# EAGLE design Nu6509_vossi_v2 (EAGLE 7.7.0)
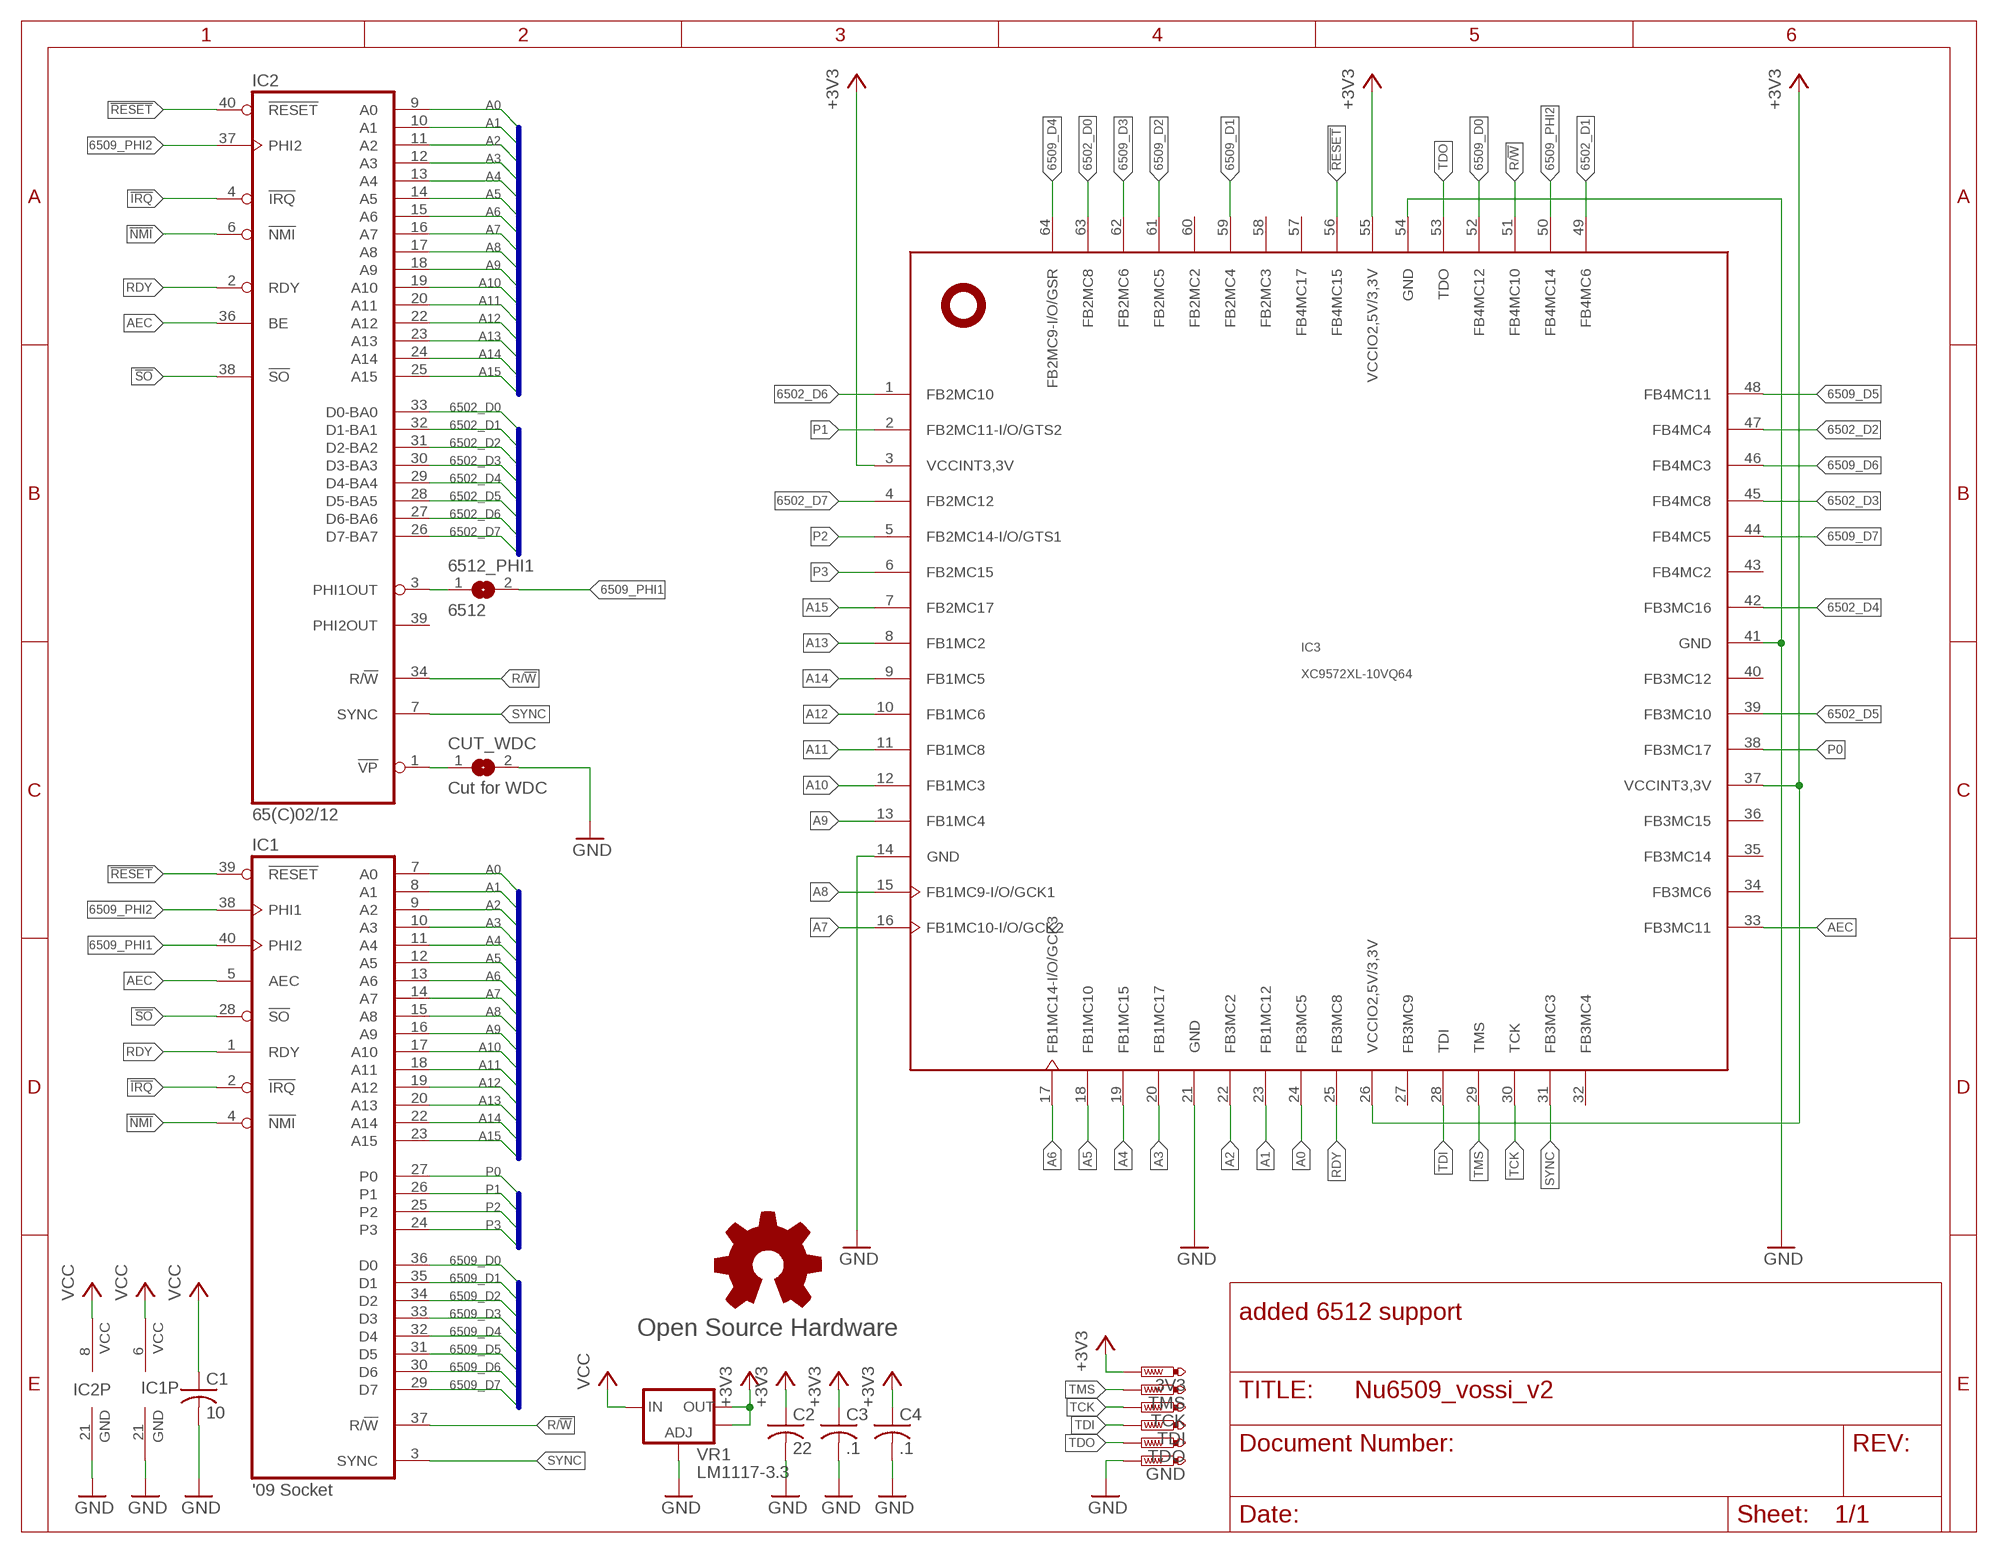
[diagram p0: schematic, sheet 1]

## Parts
3V3  PTR1TP08R  [TP08R]
6512_PHI1  6512  SJ  [SJ]
C1  10  C-USC0805  [C0805]
C2  22  C-USC0805  [C0805]
C3  .1  C-USC0805  [C0805]
C4  .1  C-USC0805  [C0805]
CUT_WDC  Cut for WDC  SJ  [SJ]
GND  PTR1TP08R  [TP08R]
GOLD_ORB_SM1  Open Source Hardware  OSHWLOGOLOGO5MM  [OSHW_5MM]
IC1  '09 Socket  6509-RP  [DIL40-ROUNDPAD]
IC2  65(C)02/12  W65C02S-RP  [DIL40-ROUNDPAD]
IC3  XC9572XL-10VQ64  XC9572XLVQG64  [VQFP64]
TCK  PTR1TP08R  [TP08R]
TDI  PTR1TP08R  [TP08R]
TDO  PTR1TP08R  [TP08R]
TMS  PTR1TP08R  [TP08R]
VR1  LM1117-3.3  V_REG_LM1117SOT223  [SOT223]

## Nets
6502_D0: IC2.33(D0-BA0) IC3.63(FB2MC8)
6502_D1: IC2.32(D1-BA1) IC3.49(FB4MC6)
6502_D2: IC2.31(D2-BA2) IC3.47(FB4MC4)
6502_D3: IC2.30(D3-BA3) IC3.45(FB4MC8)
6502_D4: IC2.29(D4-BA4) IC3.42(FB3MC16)
6502_D5: IC2.28(D5-BA5) IC3.39(FB3MC10)
6502_D6: IC2.27(D6-BA6) IC3.1(FB2MC10)
6502_D7: IC2.26(D7-BA7) IC3.4(FB2MC12)
6502_VSS: CUT_WDC.1 IC2.1(!VP)
6509_D0: IC1.36(D0) IC3.52(FB4MC12)
6509_D1: IC1.35(D1) IC3.59(FB2MC4)
6509_D2: IC1.34(D2) IC3.61(FB2MC5)
6509_D3: IC1.33(D3) IC3.62(FB2MC6)
6509_D4: IC1.32(D4) IC3.64(FB2MC9-I/O/GSR)
6509_D5: IC1.31(D5) IC3.48(FB4MC11)
6509_D6: IC1.30(D6) IC3.46(FB4MC3)
6509_D7: IC1.29(D7) IC3.44(FB4MC5)
6509_PHI1: 6512_PHI1.2 IC1.40(PHI2)
6509_PHI2: IC1.38(PHI1) IC2.37(PHI2) IC3.50(FB4MC14)
6512_PHI1: 6512_PHI1.1 IC2.3(PHI1OUT)
!IRQ: IC1.2(!IRQ) IC2.4(!IRQ)
!NMI: IC1.4(!NMI) IC2.6(!NMI)
!RESET: IC1.39(!RESET) IC2.40(!RESET) IC3.56(FB4MC15)
!SO: IC1.28(!SO) IC2.38(!SO)
+3V3: 3V3.TP C2.1 C3.1 C4.1 IC3.3(VCCINT3,3V) IC3.26(VCCIO2,5V/3,3V) IC3.37(VCCINT3,3V) IC3.55(VCCIO2,5V/3,3V) VR1.2(OUT) VR1.4(OUT)
A0: IC1.7(A0) IC2.9(A0) IC3.24(FB3MC5)
A1: IC1.8(A1) IC2.10(A1) IC3.23(FB1MC12)
A2: IC1.9(A2) IC2.11(A2) IC3.22(FB3MC2)
A3: IC1.10(A3) IC2.12(A3) IC3.20(FB1MC17)
A4: IC1.11(A4) IC2.13(A4) IC3.19(FB1MC15)
A5: IC1.12(A5) IC2.14(A5) IC3.18(FB1MC10)
A6: IC1.13(A6) IC2.15(A6) IC3.17(FB1MC14-I/O/GCK3)
A7: IC1.14(A7) IC2.16(A7) IC3.16(FB1MC10-I/O/GCK2)
A8: IC1.15(A8) IC2.17(A8) IC3.15(FB1MC9-I/O/GCK1)
A9: IC1.16(A9) IC2.18(A9) IC3.13(FB1MC4)
A10: IC1.17(A10) IC2.19(A10) IC3.12(FB1MC3)
A11: IC1.18(A11) IC2.20(A11) IC3.11(FB1MC8)
A12: IC1.19(A12) IC2.22(A12) IC3.10(FB1MC6)
A13: IC1.20(A13) IC2.23(A13) IC3.8(FB1MC2)
A14: IC1.22(A14) IC2.24(A14) IC3.9(FB1MC5)
A15: IC1.23(A15) IC2.25(A15) IC3.7(FB2MC17)
AEC: IC1.5(AEC) IC2.36(BE) IC3.33(FB3MC11)
GND: C1.2 C2.2 C3.2 C4.2 CUT_WDC.2 GND.TP IC1.21(GND) IC2.21(GND) IC3.14(GND) IC3.21(GND) IC3.41(GND) IC3.54(GND) VR1.1(ADJ)
P0: IC1.27(P0) IC3.38(FB3MC17)
P1: IC1.26(P1) IC3.2(FB2MC11-I/O/GTS2)
P2: IC1.25(P2) IC3.5(FB2MC14-I/O/GTS1)
P3: IC1.24(P3) IC3.6(FB2MC15)
R/!W: IC1.37(R/!W) IC2.34(R/!W) IC3.51(FB4MC10)
RDY: IC1.1(RDY) IC2.2(RDY) IC3.25(FB3MC8)
SYNC: IC1.3(SYNC) IC2.7(SYNC) IC3.31(FB3MC3)
TCK: IC3.30(TCK) TCK.TP
TDI: IC3.28(TDI) TDI.TP
TDO: IC3.53(TDO) TDO.TP
TMS: IC3.29(TMS) TMS.TP
VCC: C1.1 IC1.6(VCC) IC2.8(VCC) VR1.3(IN)
Unconnected: IC2.39(PHI2OUT) IC3.27(FB3MC9) IC3.32(FB3MC4) IC3.34(FB3MC6) IC3.35(FB3MC14) IC3.36(FB3MC15) IC3.40(FB3MC12) IC3.43(FB4MC2) IC3.57(FB4MC17) IC3.58(FB2MC3) IC3.60(FB2MC2)

## Buses
A[0..15]
6502_D[0..7]
P[0..3]
6509_D[0..7]

## Notes on the sheet
- added 6512 support

## Library data of the parts
3V3 GND TCK TDI TDO TMS = testpad:PTR1: TEST PIN
6512_PHI1 CUT_WDC = jumper-jlb:SJ: SMD solder JUMPER
C1-C4 = rcl:C-US: CAPACITOR, American symbol
GOLD_ORB_SM1 = oshw:OSHWLOGO: The OSHW logo for PCB layout
IC1 = commodore:6509
IC2 = commodore:W65C02S: WDC W65C02S
IC3 = xilinx_xc95XXXxl:XC9572XLVQG64
VR1 = SparkFun:V_REG_LM1117: Voltage Regulator LM1117 Standard adjustable voltage regulator but in SMD form. Spark Fun Electronics SKU : COM-00595

## Board
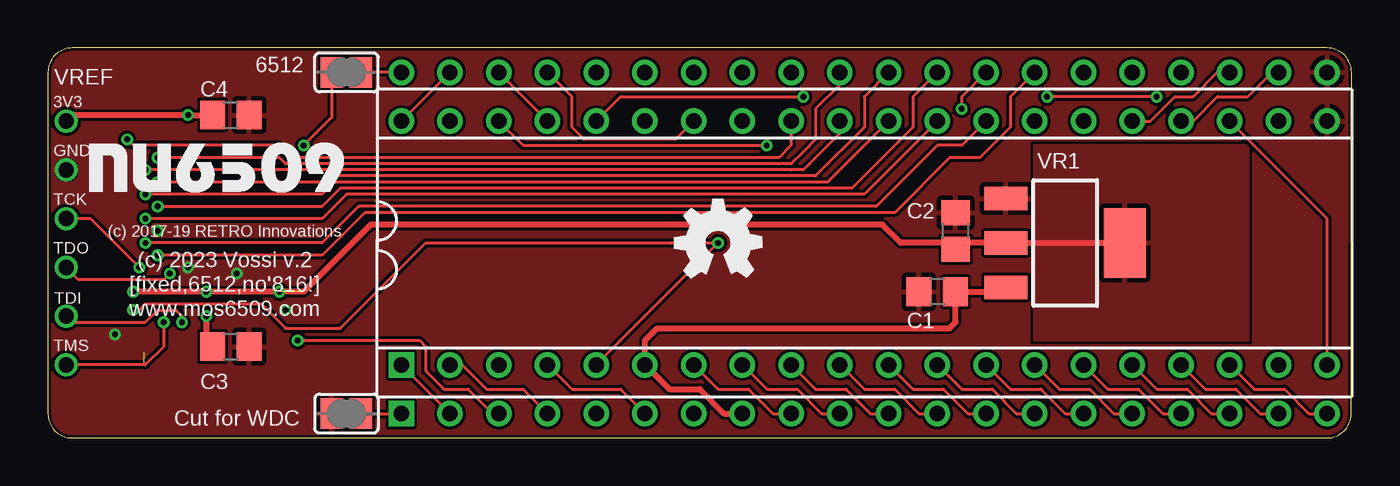
[diagram p1: board, top side]
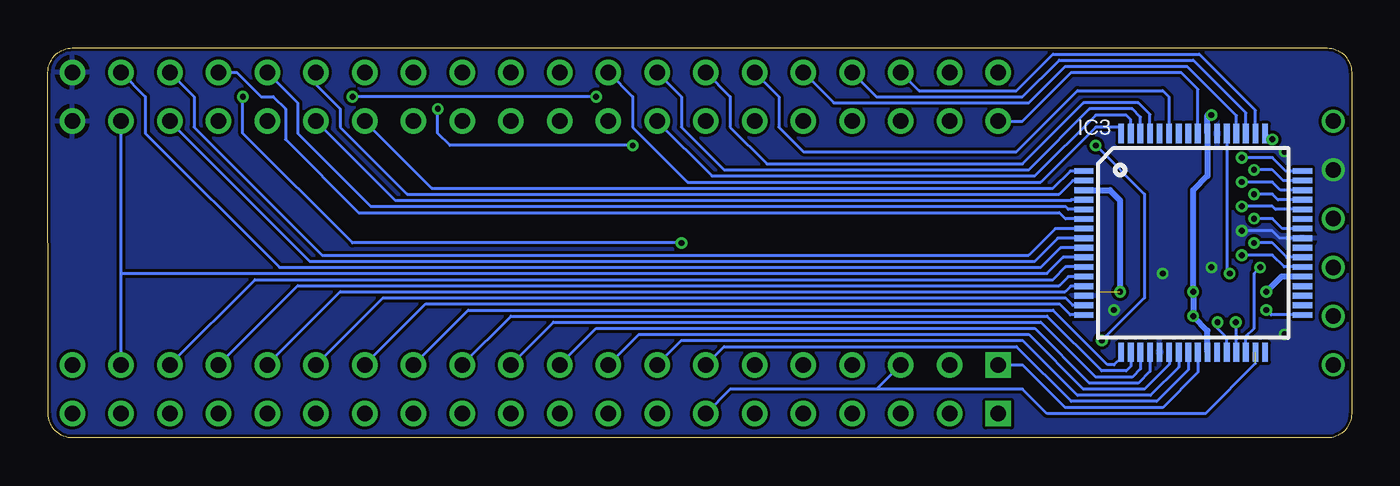
[diagram p2: board, bottom side, seen from below]

Size 67.94 x 20.32 mm. Coordinates in mm from the lower left corner, seen from the top.
Outline: 0,19.05 0,1.27 arc90 1.27,0 66.66,0 arc90 67.93,1.27 67.94,19.05 arc90 66.67,20.32 1.27,20.32 arc90 0,19.05
Copper layers (1*16): Top 0.035mm / dielectric 1.5mm / Bottom 0.035mm
Design rules "hackvana *": minimum track width 6mil, minimum drill 0.3mm, track to track 6mil, track to pad 6mil, pad to pad 6mil, via to via 6mil, smd to smd 0mil, copper to edge 6mil, drill to drill 6mil, minimum pad ring 10mil, minimum via ring 6mil, stop-mask expansion 2mil, vias tented up to drill 100mil, thermal gap 10mil

### Footprints (pad centres in the part's own frame; a part is rotated, then mirrored left to right if it is on the bottom)
TP08R = smd 0.8 x 0.8: TP 0,0
SJ = smd 1.168 x 1.6: 1 -0.762,0; 2 0.762,0
C0805 = smd 1.3 x 1.5: 1 -0.95,0; 2 0.95,0
DIL40-ROUNDPAD = drill 0.813 square: 1 -24.13,-7.62 | drill 0.813: 2 -21.59,-7.62; 3 -19.05,-7.62; 4 -16.51,-7.62; 5 -13.97,-7.62; 6 -11.43,-7.62; 7 -8.89,-7.62; 8 -6.35,-7.62; 9 -3.81,-7.62; 10 -1.27,-7.62; 11 1.27,-7.62; 12 3.81,-7.62; 13 6.35,-7.62; 14 8.89,-7.62; 15 11.43,-7.62; 16 13.97,-7.62; 17 16.51,-7.62; 18 19.05,-7.62; 19 21.59,-7.62; 20 24.13,-7.62; 21 24.13,7.62; 22 21.59,7.62; 23 19.05,7.62; 24 16.51,7.62; 25 13.97,7.62; 26 11.43,7.62; 27 8.89,7.62; 28 6.35,7.62; 29 3.81,7.62; 30 1.27,7.62; 31 -1.27,7.62; 32 -3.81,7.62; 33 -6.35,7.62; 34 -8.89,7.62; 35 -11.43,7.62; 36 -13.97,7.62; 37 -16.51,7.62; 38 -19.05,7.62; 39 -21.59,7.62; 40 -24.13,7.62
VQFP64 = smd 1 x 0.3: 1 -5.7,3.75; 2 -5.7,3.25; 3 -5.7,2.75; 4 -5.7,2.25; 5 -5.7,1.75; 6 -5.7,1.25; 7 -5.7,0.75; 8 -5.7,0.25; 9 -5.7,-0.25; 10 -5.7,-0.75; 11 -5.7,-1.25; 12 -5.7,-1.75; 13 -5.7,-2.25; 14 -5.7,-2.75; 15 -5.7,-3.25; 16 -5.7,-3.75; 33 5.7,-3.75; 34 5.7,-3.25; 35 5.7,-2.75; 36 5.7,-2.25; 37 5.7,-1.75; 38 5.7,-1.25; 39 5.7,-0.75; 40 5.7,-0.25; 41 5.7,0.25; 42 5.7,0.75; 43 5.7,1.25; 44 5.7,1.75; 45 5.7,2.25; 46 5.7,2.75; 47 5.7,3.25; 48 5.7,3.75 | smd 0.3 x 1: 17 -3.75,-5.7; 18 -3.25,-5.7; 19 -2.75,-5.7; 20 -2.25,-5.7; 21 -1.75,-5.7; 22 -1.25,-5.7; 23 -0.75,-5.7; 24 -0.25,-5.7; 25 0.25,-5.7; 26 0.75,-5.7; 27 1.25,-5.7; 28 1.75,-5.7; 29 2.25,-5.7; 30 2.75,-5.7; 31 3.25,-5.7; 32 3.75,-5.7; 49 3.75,5.7; 50 3.25,5.7; 51 2.75,5.7; 52 2.25,5.7; 53 1.75,5.7; 54 1.25,5.7; 55 0.75,5.7; 56 0.25,5.7; 57 -0.25,5.7; 58 -0.75,5.7; 59 -1.25,5.7; 60 -1.75,5.7; 61 -2.25,5.7; 62 -2.75,5.7; 63 -3.25,5.7; 64 -3.75,5.7
SOT223 = smd 1.219 x 2.235: 1 -2.311,-3.099; 2 0,-3.099; 3 2.311,-3.099 | smd 3.6 x 2.2: 4 0,3.099

### Placement (x,y rotation side)
3V3  0.95,16.51 0 top
6512_PHI1  15.56,19.05 0 top
C1  46.35,7.62 180 top
C2  47.31,10.79 90 top
C3  9.53,4.76 0 top
C4  9.53,16.83 0 top
CUT_WDC  15.56,1.27 180 top
GND  0.95,13.97 0 top
GOLD_ORB_SM1  34.92,10.16 0 top
IC1  42.54,11.43 0 top
IC2  42.54,8.89 0 top
IC3  8.25,10.16 0 bottom
TCK  0.95,11.43 0 top
TDI  0.95,6.35 0 top
TDO  0.95,8.89 0 top
TMS  0.95,3.81 0 top
VR1  53.02,10.16 270 top

### Tracks (layer width: path | path; a pad name or v marks a point on that pad's centre or on a via)
6502_D0
  Bottom 0.152: IC2.33 33.34,13.65 16.51,13.65 13.33,16.83 11.75,16.83 11.5,16.59 IC3.63
6502_D1  (via drill 0.3)
  Top 0.152: IC2.32 38.73,15.24 38.1,14.61 12.7,14.61 12.06,15.24 4.45,15.24 v4.13,15.56
  Bottom 0.152: IC3.49 4.43,15.86 v4.13,15.56
6502_D2  (via drill 0.3)
  Top 0.152: IC2.31 41.27,15.88 40,14.61 39.37,13.97 38.73,13.97 v5.08,13.97
  Bottom 0.152: IC3.47 3.57,13.41 4.13,13.97 v5.08,13.97
6502_D3  (via drill 0.3)
  Top 0.152: IC2.30 40.64,13.34 14.92,13.34 14.29,12.7 v5.08,12.7
  Bottom 0.152: IC3.45 3.84,12.41 4.13,12.7 v5.08,12.7
6502_D4  (via drill 0.3)
  Top 0.152: IC2.29 42.54,12.7 15.56,12.7 14.29,11.43 v5.08,11.43
  Bottom 0.152: IC3.42 3.61,10.91 4.13,11.43 v5.08,11.43
6502_D5  (via drill 0.3)
  Top 0.152: IC2.28 47.62,15.24 46.35,15.24 43.18,12.07 16.19,12.07 14.29,10.16 v5.08,10.16
  Bottom 0.152: IC3.39 3.38,9.41 4.13,10.16 v5.08,10.16
6502_D6
  Bottom 0.152: IC2.27 47.94,13.02 15.56,13.02 14.67,13.91 IC3.1
6502_D7
  Bottom 0.152: IC2.26 49.85,12.38 14.6,12.38 14.63,12.41 IC3.4
6502_VSS
  Top 0.152: IC2.1 16.51,1.27 CUT_WDC.1 15.24,1.27
6509_D0
  Bottom 0.152: IC1.36 26.99,17.46 16.83,17.46 14.92,19.37 8.57,19.37 6,16.8 IC3.52
6509_D1
  Bottom 0.152: IC1.35 29.85,17.78 29.85,16.19 28.57,14.92 17.46,14.92 14.29,18.1 9.84,18.1 9.5,17.76 IC3.59
6509_D2
  Bottom 0.152: IC1.34 32.38,17.78 32.38,16.19 30.48,14.29 17.14,14.29 13.97,17.46 11.11,17.46 10.5,16.86 IC3.61
6509_D3
  Bottom 0.152: IC1.33 34.92,17.78 34.92,16.19 32.7,13.97 16.83,13.97 13.65,17.14 11.43,17.14 11,16.72 IC3.62
6509_D4
  Bottom 0.152: IC1.32 37.46,17.78 37.46,16.19 34.61,13.34 16.19,13.34 13.33,16.19 12.06,16.19 12,16.13 IC3.64
6509_D5  (via drill 0.3)
  Top 0.152: IC1.31 41.27,18.41 40,17.14 40,16.19 40,15.56 39.37,14.92 38.73,14.29 38.1,14.29 12.38,14.29 12.06,14.61 v5.71,14.61
  Bottom 0.152: IC3.48 3.43,13.91 4.13,14.61 v5.71,14.61
6509_D6  (via drill 0.3)
  Top 0.152: IC1.30 42.54,17.78 42.54,16.19 40,13.65 14.6,13.65 14.29,13.34 v5.71,13.34
  Bottom 0.152: IC3.46 3.7,12.91 4.13,13.34 v5.71,13.34
6509_D7  (via drill 0.3)
  Top 0.152: IC1.29 45.09,17.78 45.09,16.19 41.91,13.02 15.24,13.02 14.29,12.07 v5.71,12.07
  Bottom 0.152: IC3.44 3.97,11.91 4.13,12.07 v5.71,12.07
6509_PHI1
  Top 0.152: IC1.40 6512_PHI1.2
6509_PHI2
  Top 0.152: IC1.38 IC2.37
  Bottom 0.152: IC1.38 22.54,18.1 17.46,18.1 15.56,20 7.94,20 5,17.07 IC3.50
6512_PHI1  (via drill 0.3)
  Top 0.152: 6512_PHI1.1 14.79,16.7 v13.33,15.24 | v13.02,5.08 19.37,5.08 19.69,4.76 19.69,3.49 20.64,2.54 21.91,2.54 23.18,1.27 IC2.3
  Bottom 0.152: v13.33,15.24 10.79,12.7 10.79,7.3 v13.02,5.08
!IRQ
  Top 0.152: IC1.2 21.59,3.81 22.86,2.54 24.77,2.54 IC2.4
!NMI
  Top 0.152: IC1.4 27.3,2.54 29.85,2.54 IC2.6
!RESET
  Top 0.152: IC1.39 IC2.40
  Bottom 0.152: IC2.40 17.14,16.51 14.6,19.05 8.89,19.05 8,18.16 IC3.56
!SO  (via drill 0.3)
  Top 0.152: IC2.38 24.77,15.24 v37.46,15.24 | v47.62,17.14 47.62,17.78 IC1.28
  Bottom 0.152: v37.46,15.24 46.99,15.24 47.62,15.88 v47.62,17.14
+3V3  (via drill 0.3, 0.8)  (1 unrouted)
  Top 0.305: 4.45,7.61 v4.45,7.62 v8.25,7.62 13.33,7.62 16.83,11.11 43.5,11.11 44.45,10.16 47.31,10.16 | C4.1 v7.3,16.83 1.27,16.83 3V3.TP | VR1.4 VR1.2 47.31,10.16 | 47.31,10.16 C2.1 | v8.25,6.35 8.25,5.08 C3.1
  Bottom 0.305: IC3.26 7.5,5.6 v8.25,6.35 v8.25,7.62 8.25,12.91 7.5,13.66 IC3.55 7.5,16.83 v7.3,16.83 | IC3.3 12.59,12.91 12.06,12.38 v12.06,7.62 | IC3.37 3.65,8.41 v4.45,7.62
  other vias: 0.95,16.51
  pour Top: 51.43,15.24 62.55,15.24 62.55,5.08 51.43,5.08
A0
  Top 0.152: IC1.7 34.92,2.54 36.51,2.54 37.78,1.27 IC2.9
  Bottom 0.152: IC1.7 32.7,4.76 17.46,4.76 14.6,1.9 10.16,1.9 8.5,3.56 IC3.24
A1
  Top 0.152: IC1.8 37.46,2.54 39.05,2.54 40.32,1.27 IC2.10
  Bottom 0.152: IC1.8 34.92,5.08 17.14,5.08 14.29,2.22 10.48,2.22 9,3.69 IC3.23
A2
  Top 0.152: IC1.9 40,2.54 41.59,2.54 42.86,1.27 IC2.11
  Bottom 0.152: IC1.9 37.15,5.4 16.83,5.4 13.97,2.54 10.79,2.54 9.5,3.83 IC3.22
A3
  Top 0.152: IC1.10 42.54,2.54 44.13,2.54 45.4,1.27 IC2.12
  Bottom 0.152: IC1.10 39.37,5.71 16.51,5.71 13.65,2.86 11.11,2.86 10.5,3.47 IC3.20
A4
  Top 0.152: IC1.11 45.09,2.54 46.67,2.54 47.94,1.27 IC2.13
  Bottom 0.152: IC1.11 41.59,6.03 16.19,6.03 13.33,3.18 11.43,3.18 11,3.6 IC3.19
A5
  Top 0.152: IC1.12 47.62,2.54 49.21,2.54 50.48,1.27 IC2.14
  Bottom 0.152: IC1.12 43.81,6.35 15.87,6.35 13.02,3.49 11.75,3.49 11.5,3.73 IC3.18
A6
  Top 0.152: IC1.13 50.16,2.54 51.75,2.54 53.02,1.27 IC2.15
  Bottom 0.152: IC1.13 46.04,6.67 15.56,6.67 12.71,3.82 12.4,3.82 12.38,3.81 12,4.19 IC3.17
A7
  Top 0.152: IC1.14 52.7,2.54 54.29,2.54 55.56,1.27 IC2.16
  Bottom 0.152: IC1.14 48.26,6.99 15.24,6.99 14.67,6.41 IC3.16
A8
  Top 0.152: IC1.15 55.24,2.54 56.83,2.54 58.1,1.27 IC2.17
  Bottom 0.152: IC1.15 50.48,7.3 14.92,7.3 14.53,6.91 IC3.15
A9
  Top 0.152: IC1.16 57.78,2.54 59.37,2.54 60.64,1.27 IC2.18
  Bottom 0.152: IC1.16 52.7,7.62 14.92,7.62 14.63,7.91 IC3.13
A10
  Top 0.152: IC1.17 60.33,2.54 61.91,2.54 63.18,1.27 IC2.19
  Bottom 0.152: IC1.17 54.93,7.94 15.24,7.94 14.77,8.41 IC3.12
A11
  Top 0.152: IC1.18 62.86,2.54 64.45,2.54 65.72,1.27 IC2.20
  Bottom 0.152: IC1.18 57.15,8.26 15.56,8.26 14.9,8.91 IC3.11
A12
  Bottom 0.152: 64.13,8.57 15.87,8.57 15.04,9.41 IC3.10 | 64.13,8.57 IC2.22 | IC1.19 64.13,8.57
A13
  Top 0.152: IC1.20 66.67,11.43 IC2.23
  Bottom 0.152: IC2.23 54.29,9.21 16.51,9.21 15.31,10.41 IC3.8
A14
  Top 0.152: IC1.22 63.82,19.05 62.55,17.78 60.96,17.78 59.69,16.51 IC2.24
  Bottom 0.152: IC1.22 62.86,17.78 62.86,15.88 55.88,8.89 16.19,8.89 15.17,9.91 IC3.9
A15
  Top 0.152: IC1.23 60.96,19.05 59.69,17.78 58.74,17.78 57.47,16.51 IC2.25
  Bottom 0.152: IC1.23 60.33,17.78 60.33,16.19 53.66,9.53 16.83,9.53 15.44,10.91 IC3.7
AEC  (via drill 0.3)
  Top 0.152: IC2.36 29.85,17.78 v39.37,17.78 | IC1.5 v34.92,10.16 19.69,10.16 15.24,5.71 12.38,5.71 11.11,6.99 5.08,6.99 4.76,6.67 v4.45,6.67 | v57.78,17.78 v52.07,17.78
  Bottom 0.152: v34.92,10.16 52.07,10.16 57.78,15.88 v57.78,17.78 | v39.37,17.78 v52.07,17.78 | IC3.33 4.19,6.41 v4.45,6.67
GND  (via drill 0.3, 0.8)
  Bottom 0.152: IC3.41 3.74,10.41 4.13,10.79 v5.71,10.79
  other vias: 0.95,13.97 9.84,8.57 3.49,5.4 3.49,14.92 12.38,6.67 7.3,8.89
  pour Top (rank 2): 1.27,20.32 66.67,20.32 arc-90 67.94,19.05 67.94,1.27 arc-90 66.67,0 1.27,0 arc-90 0,1.27 0,19.05 arc-90
  pour Bottom (rank 2): 1.27,20.32 66.67,20.32 arc-90 67.94,19.05 67.94,1.27 arc-90 66.67,0 1.27,0 arc-90 0,1.27 0,19.05 arc-90
P0  (via drill 0.3)
  Top 0.152: IC1.27 50.16,17.78 50.16,16.51 50.16,16.19 48.58,14.61 46.99,14.61 44.13,11.75 16.51,11.75 14.29,9.53 v5.71,9.53
  Bottom 0.152: IC3.38 3.51,8.91 4.13,9.53 v5.71,9.53
P1
  Bottom 0.152: IC1.26 53.97,18.41 52.7,17.14 52.7,16.19 49.21,12.7 15.24,12.7 14.53,13.41 IC3.2
P2
  Bottom 0.152: IC1.25 54.93,17.46 54.93,15.88 51.12,12.07 14.92,12.07 14.77,11.91 IC3.5
P3
  Bottom 0.152: IC1.24 58.1,19.05 56.83,17.78 56.2,17.78 55.56,17.14 55.56,15.56 51.75,11.75 15.24,11.75 14.9,11.41 IC3.6
R/!W
  Top 0.152: IC2.34 32.7,15.56 27.94,15.56 27.3,16.19 27.3,17.78 IC1.37
  Bottom 0.152: IC1.37 24.77,17.78 17.14,17.78 15.24,19.68 8.25,19.68 5.5,16.93 IC3.51
RDY
  Top 0.152: IC1.1 IC2.2
  Bottom 0.152: IC1.1 17.14,3.81 14.92,1.59 9.84,1.59 8,3.43 IC3.25
SYNC  (1 unrouted)
  Bottom 0.152: 24.77,2.54 17.14,2.54 15.87,1.27 7.62,1.27 5,3.89 | 24.77,2.54 32.38,2.54 IC2.7 | IC1.3 24.77,2.54
TCK  (via drill 0.3, 0.8)
  Top 0.152: v4.76,8.89 2.22,11.43 TCK.TP
  Bottom 0.152: IC3.30 5.5,5.29 5.08,5.71 5.08,8.57 v4.76,8.89
  other vias: 0.95,11.43
TDI  (via drill 0.3, 0.8)
  Top 0.152: TDI.TP 1.27,6.03 5.08,6.03 5.71,6.67 6.67,6.67 6.98,6.35 v6.98,6.03
  Bottom 0.152: IC3.28 6.5,5.23 6.98,5.71 v6.98,6.03
  other vias: 0.95,6.35
TDO  (via drill 0.3 pad 0.61, 0.8)
  Top 0.152: v6.35,8.57 6.03,8.26 1.59,8.26 TDO.TP
  Bottom 0.152: IC3.53 6.5,8.73 v6.35,8.57
  other vias: 0.95,8.89
TMS  (via drill 0.3 pad 0.61, 0.8)
  Top 0.152: v6.03,6.03 6.03,4.76 5.08,3.81 TMS.TP
  Bottom 0.152: IC3.29 6,6.01 v6.03,6.03
  other vias: 0.95,3.81
VCC
  Top 0.305: IC2.8 35.24,1.27 33.97,2.54 32.38,2.54 IC1.6 31.11,5.08 31.75,5.71 46.99,5.71 47.3,6.03 C1.1 49.92,7.62 VR1.3

### Text on the board
tNames: VREF | 6512 | C:/Users/brain/projects/Nu6509/doc/Nu6509.bmp | (c) 2017-19 RETRO Innovations | (c) 2023 Vossi v.2 | [fixed,6512,no'816!] | www.mos6509.com | Cut for WDC